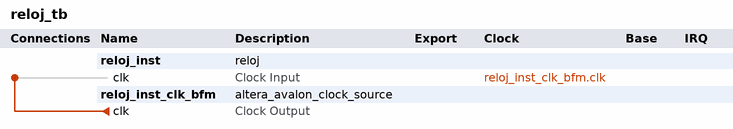
[diagram p0: system contents]
# Platform Designer (Qsys) system reloj_tb, Cyclone V 5CSEMA5F31C6
# Parameters at their usual value, and those the tool derives, are not listed.
package require -exact qsys 18.1
create_system reloj_tb
set_project_property DEVICE_FAMILY {Cyclone V}
set_project_property DEVICE 5CSEMA5F31C6

add_instance reloj_inst reloj 1.0

add_instance reloj_inst_clk_bfm altera_avalon_clock_source 18.1

# connections
add_connection reloj_inst_clk_bfm.clk reloj_inst.clk clock

set_interconnect_requirement {$system} qsys_mm.clockCrossingAdapter HANDSHAKE
set_interconnect_requirement {$system} qsys_mm.enableEccProtection FALSE
set_interconnect_requirement {$system} qsys_mm.insertDefaultSlave FALSE
set_interconnect_requirement {$system} qsys_mm.maxAdditionalLatency 1

save_system reloj_tb.qsys
